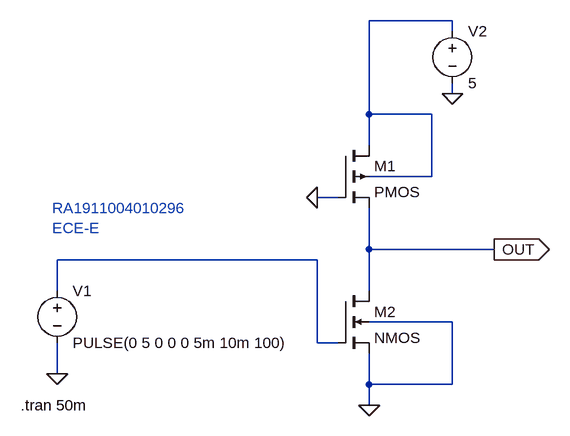
[diagram p0: schematic Expt_9.asc]
Expt_9.asc, the LTspice schematic file:
Version 4
SHEET 1 880 680
WIRE 272 -336 144 -336
WIRE 272 -320 272 -336
WIRE 272 -224 272 -240
WIRE 144 -192 144 -336
WIRE 240 -192 144 -192
WIRE 144 -144 144 -192
WIRE 240 -96 240 -192
WIRE 240 -96 144 -96
WIRE 96 -64 64 -64
WIRE 144 16 144 -48
WIRE 336 16 144 16
WIRE 64 32 -336 32
WIRE -336 80 -336 32
WIRE 144 80 144 16
WIRE 272 128 144 128
WIRE 64 160 64 32
WIRE 96 160 64 160
WIRE -336 208 -336 160
WIRE 144 224 144 176
WIRE 272 224 272 128
WIRE 272 224 144 224
WIRE 144 256 144 224
FLAG 144 256 0
FLAG 336 16 OUT
IOPIN 336 16 Out
FLAG -336 208 0
FLAG 272 -224 0
FLAG 64 -64 0
SYMBOL nmos4 96 80 R0
SYMATTR InstName M2
SYMBOL pmos4 96 -144 R0
SYMATTR InstName M1
SYMBOL voltage -336 64 R0
WINDOW 123 0 0 Left 0
WINDOW 39 0 0 Left 0
SYMATTR InstName V1
SYMATTR Value PULSE(0 5 0 0 0 5m 10m 100)
SYMBOL voltage 272 -336 R0
WINDOW 123 0 0 Left 0
WINDOW 39 0 0 Left 0
SYMATTR InstName V2
SYMATTR Value 5
TEXT -392 256 Left 2 !.tran 50m
TEXT -344 -48 Left 2 ;RA1911004010296\nECE-E

The netlist it stands for:
* Expt_9.asc
M2 OUT N002 0 0 NMOS
M1 N001 0 OUT N001 PMOS
V1 N002 0 PULSE(0 5 0 0 0 5m 10m 100)
V2 N001 0 5
.model NMOS NMOS
.model PMOS PMOS
.lib standard.mos
.tran 50m
* RA1911004010296
* ECE-E
.backanno
.end